# Altium schematic sheet 10_Clock.SchDoc: Clock
size A3; Organization: Lime Microsystems; Address1: Surrey Tech Centre; Address2: Guildford GU2 7YG; Address3: Surrey; Address4: United Kingdom; Revision: v1.0; SheetNumber: 10; SheetTotal: 11
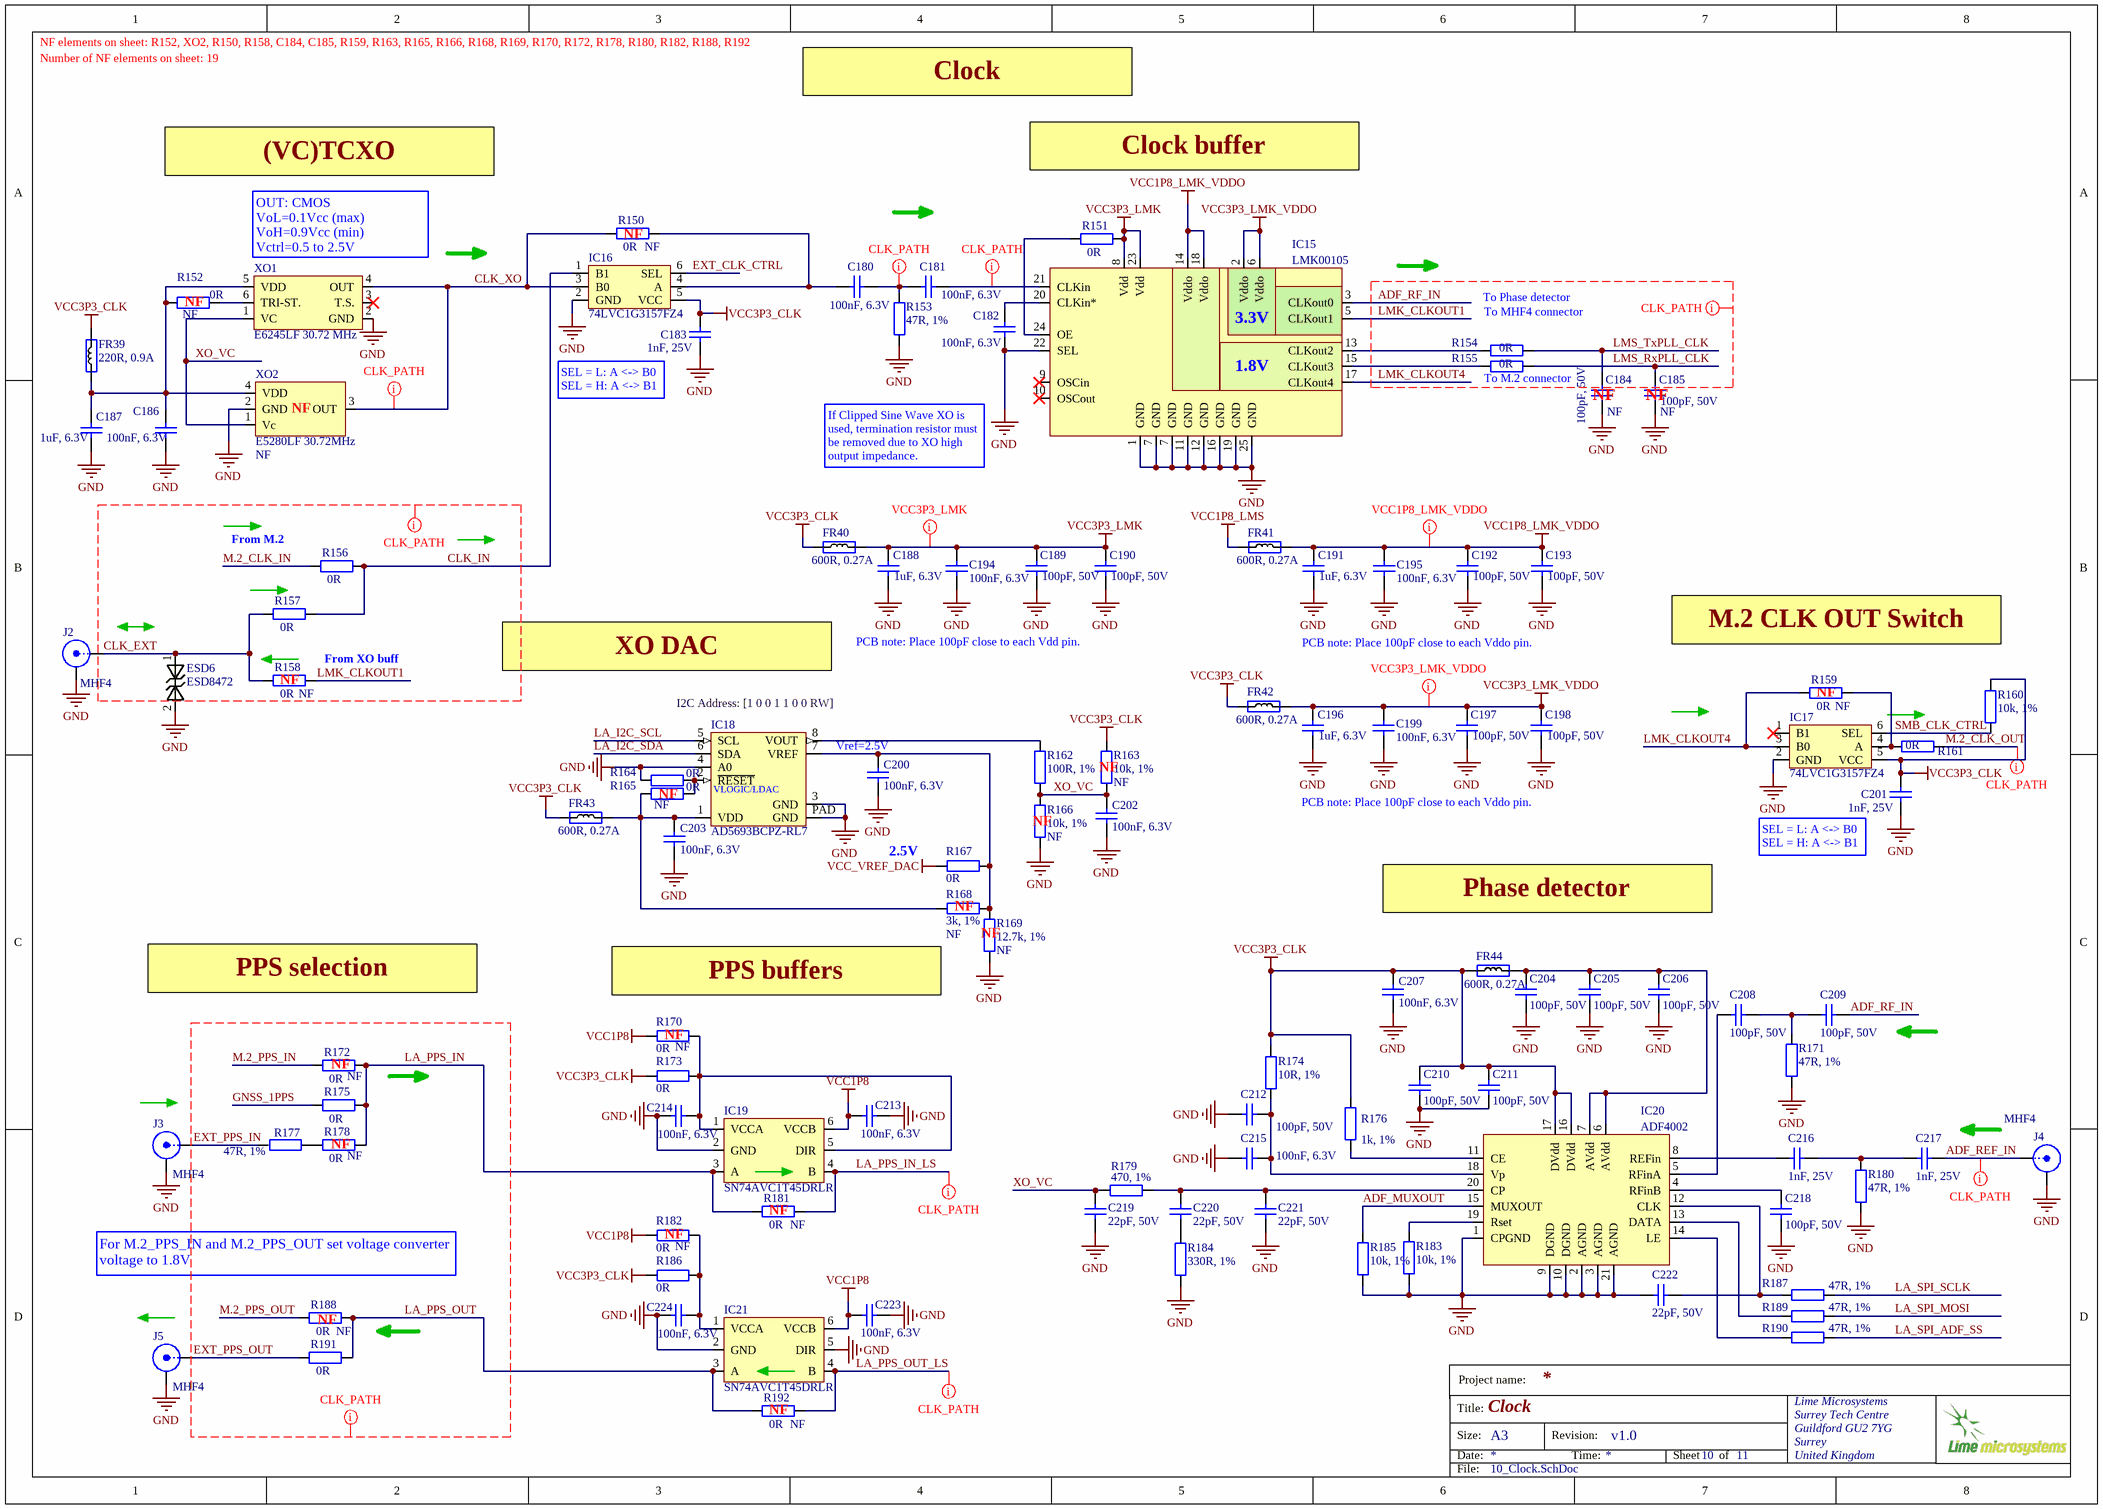
[diagram p0: 10_Clock.SchDoc]

## Parts
C180  100nF, 6.3V  [CAP0201]
C181  100nF, 6.3V  [CAP0201]
C182  100nF, 6.3V  [CAP0201]
C183  1nF, 25V  [CAP0201]
C184  100pF, 50V  Assembly Info: NF  [CAP0201]
C185  100pF, 50V  Assembly Info: NF  [CAP0201]
C186  100nF, 6.3V  [CAP0201]
C187  1uF, 6.3V  [CAP0201]
C188  1uF, 6.3V  [CAP0201]
C189  100pF, 50V  [CAP0201]
C190  100pF, 50V  [CAP0201]
C191  1uF, 6.3V  [CAP0201]
C192  100pF, 50V  [CAP0201]
C193  100pF, 50V  [CAP0201]
C194  100nF, 6.3V  [CAP0201]
C195  100nF, 6.3V  [CAP0201]
C196  1uF, 6.3V  [CAP0201]
C197  100pF, 50V  [CAP0201]
C198  100pF, 50V  [CAP0201]
C199  100nF, 6.3V  [CAP0201]
C200  100nF, 6.3V  [CAP0201]
C201  1nF, 25V  [CAP0201]
C202  100nF, 6.3V  [CAP0201]
C203  100nF, 6.3V  [CAP0201]
C204  100pF, 50V  [CAP0201]
C205  100pF, 50V  [CAP0201]
C206  100pF, 50V  [CAP0201]
C207  100nF, 6.3V  [CAP0201]
C208  100pF, 50V  [CAP0201]
C209  100pF, 50V  [CAP0201]
C210  100pF, 50V  [CAP0201]
C211  100pF, 50V  [CAP0201]
C212  100pF, 50V  [CAP0201]
C213  100nF, 6.3V  [CAP0201]
C214  100nF, 6.3V  [CAP0201]
C215  100nF, 6.3V  [CAP0201]
C216  1nF, 25V  [CAP0201]
C217  1nF, 25V  [CAP0201]
C218  100pF, 50V  [CAP0201]
C219  22pF, 50V  [CAP0201]
C220  22pF, 50V  [CAP0201]
C221  22pF, 50V  [CAP0201]
C222  22pF, 50V  [CAP0201]
C223  100nF, 6.3V  [CAP0201]
C224  100nF, 6.3V  [CAP0201]
ESD6  ESD8472  [ESD8472_X3DFN2]
FR39  220R, 0.9A  [RES0402]
FR40  600R, 0.27A  [RES0201]
FR41  600R, 0.27A  [RES0201]
FR42  600R, 0.27A  [RES0201]
FR43  600R, 0.27A  [RES0201]
FR44  600R, 0.27A  [RES0201]
IC15  LMK00105  [LMK00105SQ]
IC16  74LVC1G3157FZ4  [74LVC1G3157FZ4_SPDT_SW_DFN1410-6]
IC17  74LVC1G3157FZ4  [74LVC1G3157FZ4_SPDT_SW_DFN1410-6]
IC18  AD5693BCPZ-RL7  [AD5693RACPZ-1RL7_DAC_8LFCSP]
IC19  SN74AVC1T45DRLR  [SN74AVC1T45DRLR_SOT-5X3]
IC20  ADF4002  [ADF4002]
IC21  SN74AVC1T45DRLR  [SN74AVC1T45DRLR_SOT-5X3]
J2  MHF4  [IPEX_MHF4_conn]
J3  MHF4  [IPEX_MHF4_conn]
J4  MHF4  [IPEX_MHF4_conn]
J5  MHF4  [IPEX_MHF4_conn]
R150  0R  Assembly Info: NF  [RES0201]
R151  0R  [RES0201]
R152  0R  Assembly Info: NF  [RES0402]
R153  47R, 1%  [RES0201]
R154  0R  [RES0201]
R155  0R  [RES0201]
R156  0R  [RES0201]
R157  0R  [RES0201]
R158  0R  Assembly Info: NF  [RES0201]
R159  0R  Assembly Info: NF  [RES0201]
R160  10k, 1%  [RES0201]
R161  0R  [RES0201]
R162  100R, 1%  [RES0201]
R163  10k, 1%  Assembly Info: NF  [RES0201]
R164  0R  [RES0201]
R165  0R  Assembly Info: NF  [RES0201]
R166  10k, 1%  Assembly Info: NF  [RES0201]
R167  0R  [RES0201]
R168  3k, 1%  Assembly Info: NF  [RES0201]
R169  12.7k, 1%  Assembly Info: NF  [RES0201]
R170  0R  Assembly Info: NF  [RES0201]
R171  47R, 1%  [RES0201]
R172  0R  Assembly Info: NF  [RES0201]
R173  0R  [RES0201]
R174  10R, 1%  [RES0201]
R175  0R  [RES0201]
R176  1k, 1%  [RES0201]
R177  47R, 1%  [RES0201]
R178  0R  Assembly Info: NF  [RES0201]
R179  470, 1%  [RES0201]
R180  47R, 1%  [RES0201]
R181  0R  Assembly Info: NF  [RES0201]
R182  0R  Assembly Info: NF  [RES0201]
R183  10k, 1%  [RES0201]
R184  330R, 1%  [RES0201]
R185  10k, 1%  [RES0201]
R186  0R  [RES0201]
R187  47R, 1%  [RES0201]
R188  0R  Assembly Info: NF  [RES0201]
R189  47R, 1%  [RES0201]
R190  47R, 1%  [RES0201]
R191  0R  [RES0201]
R192  0R  Assembly Info: NF  [RES0201]
XO1  E6245LF 30.72 MHz  [RAKON_RPT7050A]
XO2  E5280LF 30.72MHz  Assembly Info: NF  [RAKON_TXCO]

## Nets
GND: C182.1 C183.1 C184.1 C185.1 C186.2 C187.2 C188.2 C189.1 C190.1 C191.2 C192.1 C193.1 C194.1 C195.1 C196.2 C197.1 C198.1 C199.1 C200.2 C201.1 C202.2 C203.2 C204.1 C205.1 C206.1 C207.2 C210.1 C211.1 C212.2 C213.2 C214.1 C215.1 C218.1 C219.1 C221.1 C222.2 C223.2 C224.1 ESD6.2 IC15.1(GND) IC15.7(GND) IC15.11(GND) IC15.12(GND) IC15.16(GND) IC15.19(GND) IC15.22(SEL) IC15.25(GND) IC16.2(GND) IC17.2(GND) IC18.3(GND) IC18.4(A0) IC18.PAD(GND) IC19.2(GND) IC20.1(CPGND) IC20.2(AGND) IC20.3(AGND) IC20.9(DGND) IC20.10(DGND) IC20.21(AGND) IC21.2(GND) IC21.5(DIR) J2.2(Y) J3.2(Y) J4.2(Y) J5.2(Y) R153.2 R164.1 R166.2 R169.2 R171.2 R180.1 R183.2 R184.2 R185.2 XO1.2(GND) XO2.2(GND)
VCC1P8: C213.1 C223.1 IC19.6(VCCB) IC21.6(VCCB) R170.2 R182.2
VCC1P8_LMK_VDDO: C191.1 C192.2 C193.2 C195.2 FR41.2 IC15.14(Vddo) IC15.18(Vddo)
VCC1P8_LMS: FR41.1
VCC3P3_CLK: C183.2 C201.2 C207.1 C210.2 C211.2 FR39.2 FR40.1 FR42.1 FR43.1 FR44.1 IC16.5(VCC) IC17.5(VCC) IC20.16(DVdd) IC20.17(DVdd) R160.2 R163.1 R173.2 R174.2 R176.1 R186.2
VCC3P3_LMK: C188.1 C189.2 C190.2 C194.2 FR40.2 IC15.8(Vdd) IC15.23(Vdd) R151.2
VCC3P3_LMK_VDDO: C196.1 C197.2 C198.2 C199.2 FR42.2 IC15.2(Vddo) IC15.6(Vddo)
VCC_VREF_DAC: R167.2
ADF_MUXOUT: IC20.15(MUXOUT) R185.1
ADF_REF_IN: C217.2 J4.1(X)
ADF_RF_IN: C209.1 IC15.3(CLKout0)
CLK_EXT: ESD6.1 J2.1(X) R157.1 R158.1
CLK_IN: IC16.1(B1) R156.2 R157.2
CLK_XO: IC16.3(B0) R150.1 XO1.4(OUT) XO2.3(OUT)
EXT_CLK_CTRL: IC16.6(SEL)
EXT_PPS_IN: J3.1(X) R177.2
EXT_PPS_OUT: J5.1(X) R191.1
GNSS_1PPS: R175.1
LA_I2C_SCL: IC18.5(SCL)
LA_I2C_SDA: IC18.6(SDA)
LA_PPS_IN: IC19.3(A) R172.2 R175.2 R178.2 R181.1
LA_PPS_IN_LS: IC19.4(B) R181.2
LA_PPS_OUT: IC21.3(A) R188.2 R191.2 R192.1
LA_PPS_OUT_LS: IC21.4(B) R192.2
LA_SPI_ADF_SS: R190.2
LA_SPI_MOSI: R189.2
LA_SPI_SCLK: R187.2
LMK_CLKOUT1: IC15.5(CLKout1) R158.2
LMK_CLKOUT4: IC15.17(CLKout4) IC17.3(B0) R159.1
LMS_RxPLL_CLK: C185.2 R155.2
LMS_TxPLL_CLK: C184.2 R154.2
M.2_CLK_IN: R156.1
M.2_CLK_OUT: R161.2
M.2_PPS_IN: R172.1
M.2_PPS_OUT: R188.1
SMB_CLK_CTRL: IC17.6(SEL) R160.1
XO_VC: C202.1 C219.2 R162.2 R163.2 R166.1 R179.1 XO1.1(VC) XO2.1(Vc)
NetC180_1: C180.1 C181.1 R153.1
NetC180_2: C180.2 IC16.4(A) R150.2
NetC181_2: C181.2 IC15.21(CLKin)
NetC182_2: C182.2 IC15.20(CLKin*)
NetC186_1: C186.1 C187.1 FR39.1 R152.2 XO1.5(VDD) XO2.4(VDD)
NetC200_1: C200.1 IC18.7(VREF) R167.1 R168.1 R169.1
NetC203_1: C203.1 FR43.2 IC18.1(VDD) R165.1 R168.2
NetC204_2: C204.2 C205.2 C206.2 FR44.2 IC20.6(AVdd) IC20.7(AVdd)
NetC208_1: C208.1 C209.2 R171.1
NetC208_2: C208.2 IC20.5(RFinA)
NetC212_1: C212.1 C215.2 IC20.18(Vp) R174.1
NetC214_2: C214.2 IC19.1(VCCA) IC19.5(DIR) R170.1 R173.1
NetC216_1: C216.1 IC20.8(REFin)
NetC216_2: C216.2 C217.1 R180.2
NetC218_2: C218.2 IC20.4(RFinB)
NetC220_1: C220.1 R184.1
NetC220_2: C220.2 C221.2 IC20.20(CP) R179.2
NetC222_1: C222.1 IC20.12(CLK) R187.1
NetC224_2: C224.2 IC21.1(VCCA) R182.1 R186.1
NetIC15_13: IC15.13(CLKout2) R154.1
NetIC15_15: IC15.15(CLKout3) R155.1
NetIC15_24: IC15.24(OE) R151.1
NetIC17_4: IC17.4(A) R159.2 R161.1
NetIC18_2: IC18.2(~{RESET}) R164.2 R165.2
NetIC18_8: IC18.8(VOUT) R162.1
NetIC20_11: IC20.11(CE) R176.2
NetIC20_13: IC20.13(DATA) R189.1
NetIC20_14: IC20.14(LE) R190.1
NetIC20_19: IC20.19(Rset) R183.1
NetR152_1: R152.1 XO1.6(TRI-ST.)
NetR177_1: R177.1 R178.1

Not connected (* = marked no-connect by the designer): IC15 9(OSCin)* 10(OSCout)*; IC17 1(B1)*; XO1 3(T.S.)*

## Layout directives
net class CLK_PATH: ADF_REF_IN, ADF_RF_IN, CLK_EXT, CLK_IN, CLK_XO, EXT_PPS_IN, EXT_PPS_OUT, GNSS_1PPS, LA_PPS_IN, LA_PPS_IN_LS, LA_PPS_OUT, LA_PPS_OUT_LS, LMK_CLKOUT1, LMK_CLKOUT4, LMS_RxPLL_CLK, LMS_TxPLL_CLK, M.2_CLK_IN, M.2_CLK_OUT, M.2_PPS_IN, M.2_PPS_OUT, NetC180_1, NetC181_2
net class VCC3P3_LMK: VCC3P3_LMK
net class VCC3P3_LMKRF: VCC1P8_LMK_VDDO
net class VCC3P3_LMK_VDDO: VCC3P3_LMK_VDDO

## Notes on the sheet
- NF elements on sheet: R152, XO2, R150, R158, C184, C185, R159, R163, R165, R166, R168, R169, R170, R172, R178, R180, R182, R188, R192
- Number of NF elements on sheet: 19
- Clock
- (VC)TCXO
- Clock buffer
- (near R150) NF
- (near R152) NF
- (near XO1) OUT: CMOS
  VoL=0.1Vcc (max)
  VoH=0.9Vcc (min)
  Vctrl=0.5 to 2.5V
- To Phase detector
- To MHF4 connector
- (near IC15) 1.8V
- (near IC15) 3.3V
- (near R155) To M.2 connector
- (near XO2) NF
- SEL = L: A <-> B0
  SEL = H: A <-> B1
- (near C184) NF
- (near C185) NF
- If Clipped Sine Wave XO is used, termination resistor must be removed due to XO high output impedance.
- From M.2
- PCB note: Place 100pF close to each Vdd pin.
- PCB note: Place 100pF close to each Vddo pin.
- M.2 CLK OUT Switch
- (near R158) NF
- (near R158) From XO buff
- XO DAC
- (near IC18) I2C Address: [1 0 0 1 1 0 0 RW]
- (near R159) NF
- (near C200) Vref=2.5V
- (near R163) NF
- (near R165) NF
- (near IC18) VLOGIC/LDAC
- (near R167) 2.5V
- (near R166) NF
- (near R168) NF
- Phase detector
- PPS selection
- PPS buffers
- (near R169) NF
- (near R170) NF
- (near R172) NF
- (near R178) NF
- (near R182) NF
- (near R181) NF
- (near R188) For M.2_PPS_IN and M.2_PPS_OUT set voltage converter voltage to 1.8V
- (near R188) NF
- (near R192) NF
- Project name:
- Title:
- Size:
- Date:
- A3
- Revision:
- Time:
- Sheet
- of
- File:

## Library data of the parts
C180-C182 C186 C194 C195 C199 C200 C202 C203 C207 C213-C215 C223 C224 = Cap_0402: Part Description: 0.1 µF ±20% 10V Ceramic Capacitor X5R 0201 (0603 Metric); Manufacturer: Samsung; Manufacturer Part Number 1: CL03A104MP3NNNC; Tolerance: 20%; Voltage Rating (DC): 10V; Value: 100nF, 6.3V; Capacitance: 100nF; Case/Package: 0201; Case Code (Imperial): 0201; Case Code (Metric): 0603; ComponentLink5Description: https://datasheet.ciiva.com/25788/cl03a104mp3nnnc-25788272.pdf?src-supplier=Digi-Key; ComponentLink5URL: https://datasheet.ciiva.com/25788/cl03a104mp3nnnc-25788272.pdf?src-supplier=Digi-Key; Length: 0.024inch; Max Operating Temperature: 85°C; Min Operating Temperature: -55°C; Mount: Surface Mount; Package Quantity: 1; Packaging: Tape and Reel; Pricing 1: 1=0,10000, 10=0,03000, 50=0,01640, 100=0,01330, 500=0,00950, 1000=0,00747, 2500=0,00679, 5000=0,00625 (USD); RoHS: Yes; RoHS Compliant: Yes; Series: CL; Stock 1: 3817176; Supplier 1: Digi-Key; Supplier Part Number 1: 1276-1321-1-ND; Thickness: 0.013inch; Voltage Rating: 10V; Width: 0.012inch
C183 C201 C216 C217 = Cap_0402: Manufacturer Part Number 1: C0603X7R1E102K030BA; Manufacturer: TDK Corporation; Part Description: 1000pF ±10% 25V X7R Ceramic Capacitor -55°C ~ 125°C Surface Mount, MLCC 0201 (0603 Metric) 0.024" L x 0.012" W (0.60mm x 0.30mm); Temperature Coefficient: X7R; Tolerance: ±10%; Capacitance: 1000pF; Value: 1nF, 25V; Supplier 1: Digi-Key; Supplier Part Number 1: 445-7275-1-ND; Voltage - Rated: 25V; Features: -; Package / Case: 0201 (0603 Metric); Lead Spacing: -; Mounting Type: Surface Mount, MLCC; Lead Style: -; Height - Seated (Max): -; Operating Temperature: -55°C ~ 125°C; Size / Dimension: 0.024" L x 0.012" W (0.60mm x 0.30mm); Applications: General Purpose; Ratings: -; Thickness (Max): 0.013" (0.33mm); RoHS: RoHS Compliant; Packaging: Cut Tape (CT); Category: Capacitors
C184 C185 C189 C190 C192 C193 C197 C198 = Cap_0402: Part Description: 100 pF ±5% 50V Ceramic Capacitor C0G, NP0 0201 (0603 Metric); Manufacturer: TDK; Manufacturer Part Number 1: C0603C0G1H101J030BA; Dielectric Material: Ceramic; Tolerance: 5%; Dielectric: C0G; Insulation Resistance: 10GR; Value: 100pF, 50V; Supplier 1: Digi-Key; Supplier Part Number 1: 445-1786-1-ND; Stock 1: 367528; Pricing 1: 1=0,10000, 10=0,06000, 50=0,03280, 100=0,02670, 500=0,01908, 1000=0,01500, 2500=0,01364, 5000=0,01254 (USD); RoHS: Yes; Mount: Surface Mount; Case/Package: 0201; Number of Pins: 2; Case Code (Metric): 0603; Case Code (Imperial): 0201; Weight: 6E-06oz; Min Operating Temperature: -55°C; Max Operating Temperature: 125°C; Package Quantity: 1; Capacitance: 100pF; Voltage Rating: 50V; Packaging: Tape and Reel; Voltage Rating (DC): 50V; Termination: SMD/SMT; Voltage: 50V; Series: C; Construction: Flat; Length: 0.6mm; Width: 0.012inch; Height: 0.3mm; Thickness: 0.013inch; Depth: 0.3mm; Reach SVHC Compliant: Yes; Lead Free: Lead Free; RoHS Compliant: Yes; ComponentLink1URL: https://datasheet.ciiva.com/24217/c0603c0g1h101j030ba-264106-24217425.pdf?src-supplier=Mouser; ComponentLink1Description: https://datasheet.ciiva.com/24217/c0603c0g1h101j030ba-264106-24217425.pdf?src-supplier=Mouser; ComponentLink2URL: https://datasheet.ciiva.com/16205/mlcc-commercial-general-en-16205590.pdf?src-supplier=Future+Electronics; ComponentLink2Description: https://datasheet.ciiva.com/16205/mlcc-commercial-general-en-16205590.pdf?src-supplier=Future+Electronics; ComponentLink3URL: https://datasheet.ciiva.com/6250/tdkmlcccaprange-6250351.pdf?src-supplier=Digi-Key; ComponentLink3Description: https://datasheet.ciiva.com/6250/tdkmlcccaprange-6250351.pdf?src-supplier=Digi-Key
C187 C188 C191 C196 = Cap_0402: Manufacturer: TDK Corporation; Manufacturer Part Number 1: JMK063ABJ105MP-F; Part Description: 1µF ±20% 6.3V X5R Ceramic Capacitor -55°C ~ 85°C Surface Mount, MLCC 0201 (0603 Metric) 0.024" L x 0.012" W (0.60mm x 0.30mm); Value: 1uF, 20%; Tolerance: ±20%; Capacitance: 1.0µF; Temperature Coefficient: X5R; Supplier 1: Digi-Key; Supplier Part Number 1: 587-5864-2-ND; Applications: General Purpose; Features: -; Lead Style: -; Ratings: -; Thickness (Max): -; Lead Spacing: -; Height - Seated (Max): -; Size / Dimension: 0.024" L x 0.012" W (0.60mm x 0.30mm); Mounting Type: Surface Mount, MLCC; Operating Temperature: -55°C ~ 85°C; Package / Case: 0201 (0603 Metric); Packaging: Cut Tape (CT); Voltage - Rated: 6.3V; Category: Capacitors; RoHS: RoHS Compliant
C204-C206 C208-C212 C218 = Cap_0402: Part Description: 100 pF ±5% 50V Ceramic Capacitor C0G, NP0 0201 (0603 Metric); Manufacturer: TDK; Manufacturer Part Number 1: C0603C0G1H101J030BA; Dielectric: C0G; Dielectric Material: Ceramic; Insulation Resistance: 10GR; Tolerance: 5%; Value: 100pF, 50V; Capacitance: 100pF; Case/Package: 0201; Case Code (Imperial): 0201; Case Code (Metric): 0603; ComponentLink1Description: https://datasheet.ciiva.com/24217/c0603c0g1h101j030ba-264106-24217425.pdf?src-supplier=Mouser; ComponentLink1URL: https://datasheet.ciiva.com/24217/c0603c0g1h101j030ba-264106-24217425.pdf?src-supplier=Mouser; ComponentLink2Description: https://datasheet.ciiva.com/16205/mlcc-commercial-general-en-16205590.pdf?src-supplier=Future+Electronics; ComponentLink2URL: https://datasheet.ciiva.com/16205/mlcc-commercial-general-en-16205590.pdf?src-supplier=Future+Electronics; ComponentLink3Description: https://datasheet.ciiva.com/6250/tdkmlcccaprange-6250351.pdf?src-supplier=Digi-Key; ComponentLink3URL: https://datasheet.ciiva.com/6250/tdkmlcccaprange-6250351.pdf?src-supplier=Digi-Key; Construction: Flat; Depth: 0.3mm; Height: 0.3mm; Lead Free: Lead Free; Length: 0.6mm; Max Operating Temperature: 125°C; Min Operating Temperature: -55°C; Mount: Surface Mount; Number of Pins: 2; Package Quantity: 1; Packaging: Tape and Reel; Pricing 1: 1=0,10000, 10=0,06000, 50=0,03280, 100=0,02670, 500=0,01908, 1000=0,01500, 2500=0,01364, 5000=0,01254 (USD); Reach SVHC Compliant: Yes; RoHS: Yes; RoHS Compliant: Yes; Series: C; Stock 1: 367528; Supplier 1: Digi-Key; Supplier Part Number 1: 445-1786-1-ND; Termination: SMD/SMT; Thickness: 0.013inch; Voltage: 50V; Voltage Rating (DC): 50V; Voltage Rating: 50V; Weight: 6E-06oz; Width: 0.012inch
C219-C222 = Cap_0402: Manufacturer: Murata; Manufacturer Part Number 1: GRM0335C1H220JA01D; Part Description: 22 pF ±5% 50V Ceramic Capacitor C0G, NP0 0201 (0603 Metric); Tolerance: 5%; Dielectric: C0G; Value: 22pF, 50V; Supplier 1: Digi-Key; Supplier Part Number 1: 490-6123-1-ND; Stock 1: 2966748; Pricing 1: 1=0,10000, 10=0,01300, 50=0,00720, 100=0,00590, 500=0,00424, 1000=0,00333, 2500=0,00303, 5000=0,00279 (USD); RoHS: Yes; Mount: Surface Mount; Case/Package: 0201; Case Code (Metric): 0603; Case Code (Imperial): 0201; Min Operating Temperature: -55°C; Max Operating Temperature: 125°C; Package Quantity: 15000; Capacitance: 22pF; Voltage Rating: 50V; Packaging: Tape and Reel; Termination: SMD/SMT; Voltage: 50V; Voltage Rating (DC): 50V; Series: GRM; Length: 0.6mm; Width: 0.012inch; Height: 0.3mm; Thickness: 0.013inch; Depth: 0.3mm; Lead Free: Lead Free; RoHS Compliant: Yes; ComponentLink1URL: https://datasheet.ciiva.com/6271/partnumbering-e-01-6271146.pdf?src-supplier=Digi-Key; ComponentLink1Description: https://datasheet.ciiva.com/6271/partnumbering-e-01-6271146.pdf?src-supplier=Digi-Key; ComponentLink2URL: https://datasheet.ciiva.com/6271/partnumbering-e-01-6271143.pdf?src-supplier=Digi-Key; ComponentLink2Description: https://datasheet.ciiva.com/6271/partnumbering-e-01-6271143.pdf?src-supplier=Digi-Key; ComponentLink3URL: https://datasheet.ciiva.com/6271/partnumbering-e-01-6271149.pdf?src-supplier=Digi-Key; ComponentLink3Description: https://datasheet.ciiva.com/6271/partnumbering-e-01-6271149.pdf?src-supplier=Digi-Key
ESD6 = ESD8472: Manufacturer: ON Semiconductor; Manufacturer Part Number 1: ESD8472MUT5G; Part Description: TVS DIODE 5.3VWM 14VC X3DFN2; Voltage - Reverse Standoff (Typ): 5.3V (Max); Voltage - Breakdown (Min): 7V; Voltage - Clamping (Max) @ Ipp: 14V; Current - Peak Pulse (10/1000µs): 3A (8/20µs); Power Line Protection: No; Capacitance @ Frequency: 0.2pF @ 1MHz; Supplier 1: Digi-Key; RoHS: RoHS Compliant; Category: Circuit Protection; Stock 1: 2295; Pricing 1: 1=0.39, 10=0.315, 100=0.2142, 500=0.16068, 1000=0.12051 (USD); Packaging: Cut Tape (CT); Part Status: Active; Type: Zener; Power - Peak Pulse: -; Applications: Automotive, RF Antenna; Operating Temperature: -55°C ~ 150°C (TJ); Mounting Type: Surface Mount; Package / Case: 2-XFDFN; Supplier Device Package: 2-X3DFN (0.62x0.32); ComponentLink1URL: http://www.onsemi.com/pub/Collateral/ESD8472-D.PDF; ComponentLink1Description: http://www.onsemi.com/pub/Collateral/ESD8472-D.PDF; Supplier Part Number 1: ESD8472MUT5GOSCT-ND
FR39 = Ferrite: Manufacturer: TDK Corporation; Manufacturer Part Number 1: MPZ1005S221ET000; Part Description: FERRITE BEAD 220 OHM 0402 1LN; Impedance @ Frequency: 220 Ohm @ 100MHz; Current Rating: 900mA; DC Resistance (DCR): 220 mOhm Max; Supplier 1: Digi-Key; Package / Case: 0402 (1005 Metric); Category: Filters; Supplier Part Number 1: 445-9329-2-ND; Value: 220R, 0.9A
FR40-FR44 = Ferrite: Manufacturer Part Number 1: BK0603TS601-T; Manufacturer: Taiyo Yuden; Part Description: FERRITE BEAD 600 OHM 0201 1LN; DC Resistance (DCR): 750 mOhm Max; Filter Type: Differential Mode - Single; Impedance @ Frequency: 600 Ohm @ 100MHz; Current Rating: 270mA; Value: 600R@100MHz; Supplier 1: Digi-Key; Supplier Part Number 1: 587-3277-1-ND; Size / Dimension: 0.024" L x 0.012" W (0.60mm x 0.30mm); Package / Case: 0201 (0603 Metric); Height (Max): 0.013" (0.33mm); Mounting Type: Surface Mount; Packaging: Cut Tape (CT); RoHS: RoHS Compliant; Category: Filters
IC15 = LMK00105: Manufacturer: Texas Instruments; Manufacturer Part Number 1: LMK00105SQ/NOPB; Part Description: IC CLK BUFFER 2:5 200MHZ 24WQFN; Frequency - Max: 200MHz; Voltage - Supply: 2.375 V ~ 3.45 V; Input: HCSL, LVCMOS, LVDS, LVPECL, LVTTL, SSTL, Crystal; Differential - Input:Output: Yes/No; Supplier 1: Digi-Key; Type: Fanout Buffer (Distribution), Multiplexer, Translator; Category: Integrated Circuits (ICs); Operating Temperature: -40°C ~ 85°C; Package / Case: 24-WFQFN Exposed Pad; Supplier Device Package: 24-WQFN (4x4); Supplier Part Number 1: LMK00105SQ/NOPBCT-ND
IC16 IC17 = 74LVC1G3157FZ4_SPDT_SW: Part Description: 1 Circuit IC Switch 2:1 10Ohm X2-DFN1410-6; Manufacturer: Diodes; Manufacturer Part Number 1: 74LVC1G3157FZ4-7; Number of Circuits: 1; On-State Resistance: 10R; -3db Bandwidth: 300MHz; Supplier 1: Digi-Key; Supplier Part Number 1: 74LVC1G3157FZ4-7DICT-ND; Stock 1: 158709; Pricing 1: 1=0,42000, 10=0,31200, 25=0,27320, 100=0,17670, 250=0,14628, 500=0,11702, 1000=0,08972, 2500=0,07802 (USD); RoHS: Yes; Number of Pins: 6; Min Operating Temperature: -40°C; Max Operating Temperature: 125°C; Packaging: Tape and Reel; RoHS Compliant: Yes; ComponentLink1URL: https://www.diodes.com/assets/Datasheets/74LVC1G3157.pdf?src-supplier=Digi-Key; ComponentLink1Description: https://www.diodes.com/assets/Datasheets/74LVC1G3157.pdf?src-supplier=Digi-Key; ComponentLink2URL: https://www.diodes.com/assets/product-showcases/74LVC3157-NPA-0516.pdf?src-supplier=Digi-Key; ComponentLink2Description: https://www.diodes.com/assets/product-showcases/74LVC3157-NPA-0516.pdf?src-supplier=Digi-Key
IC18 = AD5693RACPZ-1RL7_DAC: Part Description: 16 Bit Digital to Analog Converter 1 8-LFCSP-UD (2x2); Manufacturer: Analog Devices; ComponentLink1URL: http://www.mouser.com/ds/2/609/AD5693R_5692R_5691R_5693-534178.pdf?src-supplier=Mouser; ComponentLink1Description: http://www.mouser.com/ds/2/609/AD5693R_5692R_5691R_5693-534178.pdf?src-supplier=Mouser; ComponentLink2URL: https://www.analog.com/media/en/technical-documentation/data-sheets/AD5693R_5692R_5691R_5693.pdf?src-supplier=Digi-Key; ComponentLink2Description: https://www.analog.com/media/en/technical-documentation/data-sheets/AD5693R_5692R_5691R_5693.pdf?src-supplier=Digi-Key; ComponentLink3URL: http://www.analog.com/static/imported-files/data_sheets/AD5693R_5692R_5691R.pdf?src-supplier=Avnet; ComponentLink3Description: http://www.analog.com/static/imported-files/data_sheets/AD5693R_5692R_5691R.pdf?src-supplier=Avnet; ComponentLink4URL: http://www.analog.com/media/en/technical-documentation/data-sheets/AD5693R_5692R_5691R_5693.pdf?src-supplier=Digi-Key; ComponentLink4Description: http://www.analog.com/media/en/technical-documentation/data-sheets/AD5693R_5692R_5691R_5693.pdf?src-supplier=Digi-Key; Supplier 1: Digikey; Supplier Part Number 1: 505-AD5693BCPZ-RL7CT-ND; Manufacturer Part Number 1: AD5693BCPZ-RL7; Stock 1: 5532; Pricing 1: 1=9,21, 10=6,366, 25=5,6328, 100=4,8123, 250=4,41452, 500=4,17228, 1000=3,97118 (USD); RoHS: Yes; ComponentLink5URL: https://www.analog.com/media/en/technical-documentation/data-sheets/AD5693R_5692R_5691R_5693.pdf?src-supplier=Digikey; ComponentLink5Description: https://www.analog.com/media/en/technical-documentation/data-sheets/AD5693R_5692R_5691R_5693.pdf?src-supplier=Digikey; ComponentLink6URL: http://www.analog.com/media/en/technical-documentation/data-sheets/AD5693R_5692R_5691R_5693.pdf?src-supplier=Digikey; ComponentLink6Description: http://www.analog.com/media/en/technical-documentation/data-sheets/AD5693R_5692R_5691R_5693.pdf?src-supplier=Digikey; ComponentLink7URL: http://www.analog.com/static/imported-files/data_sheets/AD5693R_5692R_5691R_5693.pdf?src-supplier=Avnet; ComponentLink7Description: http://www.analog.com/static/imported-files/data_sheets/AD5693R_5692R_5691R_5693.pdf?src-supplier=Avnet; ComponentLink8URL: http://www.farnell.com/datasheets/1863077.pdf?src-supplier=Element14; ComponentLink8Description: http://www.farnell.com/datasheets/1863077.pdf?src-supplier=Element14; ComponentLink9URL: https://datasheet.octopart.com/AD5693BCPZ-RL7-Analog-Devices-datasheet-79096046.pdf?src-supplier=Element14; ComponentLink9Description: https://datasheet.octopart.com/AD5693BCPZ-RL7-Analog-Devices-datasheet-79096046.pdf?src-supplier=Element14
IC19 IC21 = SN74AVC1T45DRLR_lvl_translator: Part Description: Voltage Level Translator Bidirectional 1 Circuit 1 Channel 500Mbps SOT-5X3; Manufacturer: Texas Instruments; Supplier 1: Digi-Key; Supplier Part Number 1: 296-21022-1-ND; Manufacturer Part Number 1: SN74AVC1T45DRLR; Stock 1: 46610; Pricing 1: 1=0,68, 10=0,6, 25=0,5636, 100=0,46, 250=0,42724, 500=0,3636, 1000=0,29088 (USD); RoHS: Yes; Length: 1.6mm; Width: 1.2mm; Height: 600um; Thickness: 550um; ComponentLink1URL: https://datasheet.ciiva.com/1629/sn74avc1t45-1629536.pdf?src-supplier=Newark; ComponentLink1Description: https://datasheet.ciiva.com/1629/sn74avc1t45-1629536.pdf?src-supplier=Newark; ComponentLink2URL: https://datasheet.ciiva.com/15086/getdatasheetpartid-223729-15086386.pdf?src-supplier=Verical; ComponentLink2Description: https://datasheet.ciiva.com/15086/getdatasheetpartid-223729-15086386.pdf?src-supplier=Verical; ComponentLink3URL: https://datasheet.ciiva.com/14287/sn74avc1t45-14287328.pdf?src-supplier=Avnet; ComponentLink3Description: https://datasheet.ciiva.com/14287/sn74avc1t45-14287328.pdf?src-supplier=Avnet; ComponentLink4URL: https://datasheet.ciiva.com/22729/1862374-22729941.pdf?src-supplier=Element14; ComponentLink4Description: https://datasheet.ciiva.com/22729/1862374-22729941.pdf?src-supplier=Element14; ComponentLink5URL: https://datasheet.ciiva.com/46385/1887534-46385799.pdf?src-supplier=Element14; ComponentLink5Description: https://datasheet.ciiva.com/46385/1887534-46385799.pdf?src-supplier=Element14; ComponentLink6URL: https://datasheet.ciiva.com/14287/sn74avc1t45-14287479.pdf?src-supplier=Avnet; ComponentLink6Description: https://datasheet.ciiva.com/14287/sn74avc1t45-14287479.pdf?src-supplier=Avnet; ComponentLink7URL: https://datasheet.ciiva.com/1899/sn74avc1t45-1899278.pdf?src-supplier=Digi-Key; ComponentLink7Description: https://datasheet.ciiva.com/1899/sn74avc1t45-1899278.pdf?src-supplier=Digi-Key; ComponentLink8URL: https://datasheet.ciiva.com/1899/sn74avc1t45-1899279.pdf?src-supplier=Digi-Key; ComponentLink8Description: https://datasheet.ciiva.com/1899/sn74avc1t45-1899279.pdf?src-supplier=Digi-Key; ComponentLink9URL: https://datasheet.ciiva.com/1899/sn74avc1t45-1899280.pdf?src-supplier=Digi-Key; ComponentLink9Description: https://datasheet.ciiva.com/1899/sn74avc1t45-1899280.pdf?src-supplier=Digi-Key
IC20 = ADF4002: Manufacturer: Analog Devices Inc; Manufacturer Part Number 1: ADF4002BCPZ-RL7; Part Description: IC PLL FREQUENCY SYNTH 20-LFCSP; Ratio - Input:Output: 2:1; Differential - Input:Output: Yes/No; Input: CMOS, TTL; Voltage - Supply: 2.7 V ~ 3.3 V; Supplier 1: Digi-Key; Supplier: Digi-Key; Category: Integrated Circuits (ICs); Type: Clock/Frequency Synthesizer (RF), Phase Detector; Operating Temperature: -40°C ~ 85°C; Mounting Type: Surface Mount; Package / Case: 20-VFQFN Exposed Pad, CSP; Supplier Part Number 1: ADF4002BCPZ-RL7CT-ND
J2-J5 = RF_IF_connector: IPEX MHF4 Connector Jack, Male Pin 50 Ohms Surface Mount Solder; Manufacturer: TE Connectivity / Linx Technologies; Manufacturer Part Number 1: CONMHF4-SMD-G-T; Part Description: IPEX MHF4 Connector Jack, Male Pin 50 Ohms Surface Mount Solder; Pricing 1: 1=0,22 (USD); RoHS: No; Stock 1: 15668; Supplier 1: Digikey; Supplier Part Number 1: 343-CONMHF4-SMD-G-TCT-ND
R150 R151 R154-R159 R161 R164 R165 R170 R172 R173 R175 R178 R181 R182 R186 R188 R191 R192 = Res_0402: Part Description: 0 Ohms Jumper Chip Resistor 0201 (0603 Metric) Moisture Resistant Thick Film; Manufacturer: Yageo; Manufacturer Part Number 1: RC0201JR-070RL; Power Rating: 50mW; Tolerance: 5%; Voltage Rating: 25V; ComponentLink1URL: http://www.yageo.com/documents/recent/PYu-RC_Group_51_RoHS_L_7.pdf; ComponentLink1Description: http://www.yageo.com/documents/recent/PYu-RC_Group_51_RoHS_L_7.pdf; Value: 0R; Supplier 1: Digi-Key; Supplier Part Number 1: 311-0.0NCT-ND; Stock 1: 6252381; Pricing 1: 1=0,10000, 10=0,03700, 25=0,02680, 50=0,02020, 100=0,01500, 250=0,01140, 500=0,00912, 1000=0,00672, 5000=0,00482 (USD); RoHS: Yes; Case/Package: 0201; Case Code (Metric): 0603; Case Code (Imperial): 0201; Weight: 6E-06oz; Contact Plating: Tin,Matte; Size Code: 0201; Min Operating Temperature: -55°C; Max Operating Temperature: 125°C; Packaging: Tape and Reel; Resistance: 0R; Package Quantity: 1; Resistor Type: Thick Film; Number of Terminations: 2; Termination: SMD/SMT; Max Power Dissipation: 50mW; Voltage Rating (DC): 25V; Features: Moisture Resistant; Series: RC; Construction: Rectangular; Resistance Tolerance: 5%; Length: 0.024inch; Width: 0.012inch; Height: 0.01inch; Depth: 0.3mm; Radiation Hardening: No; Military Standard: Not; Lead Free: Lead Free; RoHS Compliant: Yes; ComponentLink2URL: https://datasheet.ciiva.com/7672/1563626-7672248.pdf?src-supplier=Element14; ComponentLink2Description: https://datasheet.ciiva.com/7672/1563626-7672248.pdf?src-supplier=Element14; ComponentLink3URL: https://datasheet.ciiva.com/7672/1563626-7672247.pdf?src-supplier=Element14; ComponentLink3Description: https://datasheet.ciiva.com/7672/1563626-7672247.pdf?src-supplier=Element14; ComponentLink4URL: https://datasheet.ciiva.com/7660/1421516-7660808.pdf?src-supplier=Element14; ComponentLink4Description: https://datasheet.ciiva.com/7660/1421516-7660808.pdf?src-supplier=Element14; ComponentLink5URL: https://datasheet.ciiva.com/46391/1421516-46391340.pdf?src-supplier=Element14; ComponentLink5Description: https://datasheet.ciiva.com/46391/1421516-46391340.pdf?src-supplier=Element14
R152 = Res_0402: Manufacturer Part Number 1: RC0402JR-070RL; Manufacturer: Yageo; Part Description: RES SMD 0.0OHM JUMPER 1/16W 0402; Resistance (Ohms): 0.0; Tolerance: Jumper; Power (Watts): 0.063W, 1/16W; Value: 0R; Supplier 1: Digi-Key; Supplier Part Number 1: 311-0.0JRTR-ND; Category: Resistors; Temperature Coefficient: -; Features: Moisture Resistant; Supplier Device Package: 0402; Height: 0.016" (0.40mm); Package / Case: 0402 (1005 Metric); Operating Temperature: -55°C ~ 155°C; Size / Dimension: 0.039" L x 0.020" W (1.00mm x 0.50mm); Composition: Thick Film; Packaging: Tape & Reel (TR); Number of Terminations: 2; RoHS: RoHS Compliant
R153 R171 R177 R180 R187 R189 R190 = Res_0402: Manufacturer: Yageo; Manufacturer Part Number 1: RC0201FR-0747RL; Part Description: 47 Ohms ±1% 0.05W, 1/20W Chip Resistor 0201 (0603 Metric) Moisture Resistant Thick Film; Power Rating: 50mW; Voltage Rating: 25V; Temperature Coefficient: 200ppm/°C; Value: 47R, 1%; Supplier 1: Digi-Key; Supplier Part Number 1: YAG2694CT-ND; Stock 1: 778022; Pricing 1: 1=0,10000, 10=0,03700, 100=0,01530, 1000=0,00685, 2500=0,00595, 5000=0,00491 (USD); RoHS: Yes; Case/Package: 0201; Case Code (Imperial): 0201; Case Code (Metric): 0603; Min Operating Temperature: -55°C; Max Operating Temperature: 125°C; Packaging: Tape and Reel; Resistance: 47R; Tolerance: 1%; Resistor Type: Thick Film; Termination: SMD/SMT; Number of Terminations: 2; Max Power Dissipation: 50mW; Features: Moisture Resistant; Series: RC; Resistance Tolerance: 1%; Length: 0.6mm; Width: 0.3mm; Height: 0.23mm; Reach SVHC Compliant: Yes; RoHS Compliant: Yes; ComponentLink1URL: https://datasheet.ciiva.com/5924/1563626-5924912.pdf?src-supplier=Farnell; ComponentLink1Description: https://datasheet.ciiva.com/5924/1563626-5924912.pdf?src-supplier=Farnell; ComponentLink2URL: https://datasheet.ciiva.com/22661/1563626-22661319.pdf?src-supplier=Element14; ComponentLink2Description: https://datasheet.ciiva.com/22661/1563626-22661319.pdf?src-supplier=Element14
R160 R163 R166 R183 R185 = Res_0402: Manufacturer: Yageo; Manufacturer Part Number 1: RC0201FR-0710KL; Part Description: 10 kOhms ±1% 0.05W, 1/20W Chip Resistor 0201 (0603 Metric) Moisture Resistant Thick Film; Resistance: 10kR; Power Rating: 50mW; Voltage Rating: 25V; Temperature Coefficient: 200ppm/°C; Value: 10k, 1%; ComponentLink1URL: https://datasheet.ciiva.com/5924/1563626-5924912.pdf?src-supplier=Farnell; ComponentLink1Description: https://datasheet.ciiva.com/5924/1563626-5924912.pdf?src-supplier=Farnell; ComponentLink2URL: https://datasheet.ciiva.com/22661/1563626-22661319.pdf?src-supplier=Element14; ComponentLink2Description: https://datasheet.ciiva.com/22661/1563626-22661319.pdf?src-supplier=Element14; Supplier 1: Digi-Key; Supplier Part Number 1: 311-10.0KMCT-ND; Stock 1: 17142315; Pricing 1: 1=0,10000, 10=0,03700, 100=0,01530, 1000=0,00685, 2500=0,00595, 5000=0,00491 (USD); RoHS: Yes; Case/Package: 0201; Number of Pins: 2; Case Code (Imperial): 0201; Case Code (Metric): 0603; Contact Plating: Tin,Matte; Weight: 6E-06oz; Min Operating Temperature: -55°C; Max Operating Temperature: 125°C; Tolerance: 1%; Packaging: Tape and Reel; Package Quantity: 10000; Termination: SMD/SMT; Resistor Type: Thick Film; Number of Terminations: 2; Max Power Dissipation: 50mW; Voltage Rating (DC): 25V; Features: Moisture Resistant; Series: RC; Resistance Tolerance: 1%; Construction: Rectangular; Working Voltage: 25V; Technology: THICK FILM; Length: 0.6mm; Width: 0.012inch; Height: 0.01inch; Depth: 0.3mm; Radiation Hardening: No; Reach SVHC Compliant: Yes; Military Standard: Not; Lead Free: Lead Free; RoHS Compliant: Yes; ComponentLink3URL: https://datasheet.ciiva.com/7660/1421516-7660807.pdf?src-supplier=Element14; ComponentLink3Description: https://datasheet.ciiva.com/7660/1421516-7660807.pdf?src-supplier=Element14; ComponentLink4URL: https://datasheet.ciiva.com/46391/1421516-46391339.pdf?src-supplier=Element14; ComponentLink4Description: https://datasheet.ciiva.com/46391/1421516-46391339.pdf?src-supplier=Element14; ComponentLink5URL: https://datasheet.ciiva.com/2467/pyu-r-int-thick-7-2467110.pdf?src-supplier=Digi-Key; ComponentLink5Description: https://datasheet.ciiva.com/2467/pyu-r-int-thick-7-2467110.pdf?src-supplier=Digi-Key; ComponentLink6URL: https://datasheet.ciiva.com/2467/pyu-r-int-thick-7-2467111.pdf?src-supplier=Digi-Key; ComponentLink6Description: https://datasheet.ciiva.com/2467/pyu-r-int-thick-7-2467111.pdf?src-supplier=Digi-Key; ComponentLink7URL: https://datasheet.ciiva.com/2467/pyu-r-int-thick-7-2467109.pdf?src-supplier=Digi-Key; ComponentLink7Description: https://datasheet.ciiva.com/2467/pyu-r-int-thick-7-2467109.pdf?src-supplier=Digi-Key
R162 = Res_0402: Manufacturer: Yageo; Manufacturer Part Number 1: RC0201FR-07100RL; Part Description: 100 Ohms ±1% 0.05W, 1/20W Chip Resistor 0201 (0603 Metric) Moisture Resistant Thick Film; Power Rating: 50mW; Voltage Rating: 25V; Temperature Coefficient: 200ppm/°C; ComponentLink1URL: http://www.yageo.com/documents/recent/PYu-RC_Group_51_RoHS_L_7.pdf; ComponentLink1Description: http://www.yageo.com/documents/recent/PYu-RC_Group_51_RoHS_L_7.pdf; Value: 100R, 1%; Supplier 1: Digi-Key; Supplier Part Number 1: 311-100MCT-ND; Stock 1: 1625377; Pricing 1: 1=0,10000, 10=0,03700, 100=0,01530, 1000=0,00685, 2500=0,00595, 5000=0,00491 (USD); RoHS: Yes; Case/Package: 0201; Case Code (Metric): 0603; Case Code (Imperial): 0201; Contact Plating: Tin,Matte; Size Code: 0201; Min Operating Temperature: -55°C; Max Operating Temperature: 125°C; Resistance: 100R; Tolerance: 1%; Packaging: Cut Tape; Package Quantity: 1; Resistor Type: Thick Film; Number of Terminations: 2; Termination: SMD/SMT; Max Power Dissipation: 50mW; Features: Moisture Resistant; Series: RC; Resistance Tolerance: 1%; Length: 0.024inch; Width: 0.012inch; Height: 0.01inch; Radiation Hardening: No; Lead Free: Lead Free; RoHS Compliant: Yes; ComponentLink2URL: https://datasheet.ciiva.com/2560/pyu-r-int-thick-7-2560866.pdf?src-supplier=Digi-Key; ComponentLink2Description: https://datasheet.ciiva.com/2560/pyu-r-int-thick-7-2560866.pdf?src-supplier=Digi-Key; ComponentLink3URL: https://datasheet.ciiva.com/2560/pyu-r-int-thick-7-2560867.pdf?src-supplier=Digi-Key; ComponentLink3Description: https://datasheet.ciiva.com/2560/pyu-r-int-thick-7-2560867.pdf?src-supplier=Digi-Key; ComponentLink4URL: https://datasheet.ciiva.com/2560/pyu-r-int-thick-7-2560865.pdf?src-supplier=Digi-Key; ComponentLink4Description: https://datasheet.ciiva.com/2560/pyu-r-int-thick-7-2560865.pdf?src-supplier=Digi-Key; ComponentLink5URL: https://datasheet.ciiva.com/8887/pyu-rc0201-51-rohs-l-8-8887865.pdf?src-supplier=Avnet; ComponentLink5Description: https://datasheet.ciiva.com/8887/pyu-rc0201-51-rohs-l-8-8887865.pdf?src-supplier=Avnet
R167 = Res_0402: Manufacturer: Yageo; Manufacturer Part Number 1: RC0201JR-070RL; Part Description: 0 Ohms Jumper Chip Resistor 0201 (0603 Metric) Moisture Resistant Thick Film; Power Rating: 50mW; Tolerance: 5%; Voltage Rating: 25V; Value: 0R; Supplier 1: Digi-Key; Supplier Part Number 1: 311-0.0NCT-ND; Stock 1: 6252381; Pricing 1: 1=0,10000, 10=0,03700, 25=0,02680, 50=0,02020, 100=0,01500, 250=0,01140, 500=0,00912, 1000=0,00672, 5000=0,00482 (USD); RoHS: Yes; Case/Package: 0201; Case Code (Metric): 0603; Case Code (Imperial): 0201; Contact Plating: Tin,Matte; Min Operating Temperature: -55°C; Max Operating Temperature: 125°C; Package Quantity: 1; Packaging: Tape and Reel; Resistance: 0R; Resistor Type: Thick Film; Number of Terminations: 2; Termination: SMD/SMT; Max Power Dissipation: 50mW; Features: Moisture Resistant; Series: RC; Resistance Tolerance: 5%; Construction: Rectangular; Length: 0.024inch; Width: 0.012inch; Height: 0.01inch; Depth: 0.3mm; Radiation Hardening: No; Military Standard: Not; Lead Free: Lead Free; RoHS Compliant: Yes; ComponentLink1URL: http://www.yageo.com/documents/recent/PYu-RC_Group_51_RoHS_L_7.pdf; ComponentLink1Description: http://www.yageo.com/documents/recent/PYu-RC_Group_51_RoHS_L_7.pdf; ComponentLink2URL: https://datasheet.ciiva.com/7672/1563626-7672248.pdf?src-supplier=Element14; ComponentLink2Description: https://datasheet.ciiva.com/7672/1563626-7672248.pdf?src-supplier=Element14; ComponentLink3URL: https://datasheet.ciiva.com/7672/1563626-7672247.pdf?src-supplier=Element14; ComponentLink3Description: https://datasheet.ciiva.com/7672/1563626-7672247.pdf?src-supplier=Element14; ComponentLink4URL: https://datasheet.ciiva.com/7660/1421516-7660808.pdf?src-supplier=Element14; ComponentLink4Description: https://datasheet.ciiva.com/7660/1421516-7660808.pdf?src-supplier=Element14; ComponentLink5URL: https://datasheet.ciiva.com/46391/1421516-46391340.pdf?src-supplier=Element14; ComponentLink5Description: https://datasheet.ciiva.com/46391/1421516-46391340.pdf?src-supplier=Element14; Size Code: 0201; Voltage Rating (DC): 25V; Weight: 6E-06oz
R168 = Res_0402: Part Description: 3 kOhms ±1% 0.05W, 1/20W Chip Resistor 0201 (0603 Metric) Moisture Resistant Thick Film; Manufacturer: Yageo; Manufacturer Part Number 1: RC0201FR-073KL; Resistance: 3kR; Max Power Dissipation: 50mW; Temperature Coefficient: 200ppm/°C; Value: 3k, 1%; Supplier 1: Digi-Key; Supplier Part Number 1: YAG2656CT-ND; Stock 1: 269780; Pricing 1: 1=0,10000, 10=0,03700, 100=0,01530, 1000=0,00685, 2500=0,00595, 5000=0,00491 (USD); RoHS: Yes; Case/Package: 0201; Case Code (Metric): 0603; Case Code (Imperial): 0201; Min Operating Temperature: -55°C; Max Operating Temperature: 125°C; Packaging: Tape and Reel; Resistor Type: Thick Film; Number of Terminations: 2; Tolerance: 1%; Features: Moisture Resistant; Length: 0.024inch; Width: 0.012inch; Height: 0.01inch; RoHS Compliant: Yes; ComponentLink1URL: http://www.yageo.com/documents/recent/PYu-RC_Group_51_RoHS_L_10.pdf?src-supplier=Digi-Key; ComponentLink1Description: http://www.yageo.com/documents/recent/PYu-RC_Group_51_RoHS_L_10.pdf?src-supplier=Digi-Key; ComponentLink2URL: http://www.yageo.com.tw/exep/pages/download/literatures/PYu-R_INT-thick_7.pdf?src-supplier=Digi-Key; ComponentLink2Description: http://www.yageo.com.tw/exep/pages/download/literatures/PYu-R_INT-thick_7.pdf?src-supplier=Digi-Key; ComponentLink3URL: http://www.yageo.com/documents/recent/PYu-RC_Group_51_RoHS_L_9.pdf?src-supplier=Digi-Key; ComponentLink3Description: http://www.yageo.com/documents/recent/PYu-RC_Group_51_RoHS_L_9.pdf?src-supplier=Digi-Key
R169 = Res_0402: Manufacturer: Yageo; Manufacturer Part Number 1: RC0201FR-0712K7L; Part Description: 12.7 kOhms ±1% 0.05W, 1/20W Chip Resistor 0201 (0603 Metric) Moisture Resistant Thick Film; Resistance: 12.7kR; Temperature Coefficient: 200ppm/°C; Max Power Dissipation: 50mW; Value: 12.7k, 1%; ComponentLink1URL: https://datasheet.ciiva.com/5924/1563626-5924912.pdf?src-supplier=Farnell; ComponentLink1Description: https://datasheet.ciiva.com/5924/1563626-5924912.pdf?src-supplier=Farnell; ComponentLink2URL: https://datasheet.ciiva.com/22661/1563626-22661319.pdf?src-supplier=Element14; ComponentLink2Description: https://datasheet.ciiva.com/22661/1563626-22661319.pdf?src-supplier=Element14; ComponentLink3URL: https://datasheet.ciiva.com/7660/1421516-7660807.pdf?src-supplier=Element14; ComponentLink3Description: https://datasheet.ciiva.com/7660/1421516-7660807.pdf?src-supplier=Element14; ComponentLink4URL: https://datasheet.ciiva.com/46391/1421516-46391339.pdf?src-supplier=Element14; ComponentLink4Description: https://datasheet.ciiva.com/46391/1421516-46391339.pdf?src-supplier=Element14; ComponentLink5URL: https://datasheet.ciiva.com/2467/pyu-r-int-thick-7-2467110.pdf?src-supplier=Digi-Key; ComponentLink5Description: https://datasheet.ciiva.com/2467/pyu-r-int-thick-7-2467110.pdf?src-supplier=Digi-Key; ComponentLink6URL: https://datasheet.ciiva.com/2467/pyu-r-int-thick-7-2467111.pdf?src-supplier=Digi-Key; ComponentLink6Description: https://datasheet.ciiva.com/2467/pyu-r-int-thick-7-2467111.pdf?src-supplier=Digi-Key; ComponentLink7URL: https://datasheet.ciiva.com/2467/pyu-r-int-thick-7-2467109.pdf?src-supplier=Digi-Key; ComponentLink7Description: https://datasheet.ciiva.com/2467/pyu-r-int-thick-7-2467109.pdf?src-supplier=Digi-Key; Supplier 1: Digi-Key; Supplier Part Number 1: 311-12.7KMCT-ND; Stock 1: 49027; Pricing 1: 1=0,10000, 10=0,03700, 100=0,01500, 1000=0,00672, 2500=0,00583, 5000=0,00482 (USD); RoHS: Yes; Case/Package: 0201; Case Code (Metric): 0603; Case Code (Imperial): 0201; Min Operating Temperature: -55°C; Max Operating Temperature: 125°C; Package Quantity: 1; Tolerance: 1%; Packaging: Tape and Reel; Resistor Type: Thick Film; Number of Terminations: 2; Features: Moisture Resistant; Series: RC; Length: 0.024inch; Width: 0.012inch; Height: 0.01inch; RoHS Compliant: Yes; ComponentLink8URL: https://datasheet.ciiva.com/2493/pyu-r-int-thick-7-2493806.pdf?src-supplier=Digi-Key; ComponentLink8Description: https://datasheet.ciiva.com/2493/pyu-r-int-thick-7-2493806.pdf?src-supplier=Digi-Key; ComponentLink9URL: https://datasheet.ciiva.com/2493/pyu-r-int-thick-7-2493807.pdf?src-supplier=Digi-Key; ComponentLink9Description: https://datasheet.ciiva.com/2493/pyu-r-int-thick-7-2493807.pdf?src-supplier=Digi-Key; ComponentLink10URL: https://datasheet.ciiva.com/2493/pyu-r-int-thick-7-2493805.pdf?src-supplier=Digi-Key; ComponentLink10Description: https://datasheet.ciiva.com/2493/pyu-r-int-thick-7-2493805.pdf?src-supplier=Digi-Key
R174 = Res_0402: Manufacturer: Panasonic Electronic Components; Part Description: RES SMD 10 OHM 1% 1/20W 0201; Manufacturer Part Number 1: ERJ-1GEF10R0C; Power (Watts): 0.05W, 1/20W; Resistance (Ohms): 10; Temperature Coefficient: ±200ppm/°C; Value: 10R, 1%; Supplier 1: Digi-Key; Supplier Part Number 1: P10.0ABCT-ND; Package / Case: 0201 (0603 Metric); Height: 0.010" (0.26mm); Supplier Device Package: 0201; Packaging: Cut Tape (CT); Composition: Thick Film; Category: Resistors; Tolerance: ±1%; Number of Terminations: 2; Size / Dimension: 0.024" L x 0.012" W (0.60mm x 0.30mm); Operating Temperature: -55°C ~ 125°C; Features: -; RoHS: RoHS Compliant
R176 = Res_0402: Manufacturer: Yageo; Manufacturer Part Number 1: RC0201FR-071KL; Part Description: 1 kOhms ±1% 0.05W, 1/20W Chip Resistor 0201 (0603 Metric) Moisture Resistant Thick Film; Resistance: 1kR; Power Rating: 50mW; Voltage Rating: 25V; Temperature Coefficient: 200ppm/°C; Value: 1k, 1%; Supplier 1: Digi-Key; Supplier Part Number 1: 311-1KMDKR-ND; Stock 1: 9099863; Pricing 1: 1=0,10000, 10=0,03700, 100=0,01530, 1000=0,00685, 2500=0,00595, 5000=0,00491 (USD); RoHS: Yes; Case/Package: 0201; Case Code (Metric): 0603; Case Code (Imperial): 0201; Contact Plating: Tin,Matte; Min Operating Temperature: -55°C; Max Operating Temperature: 125°C; Package Quantity: 10000; Packaging: Tape and Reel; Tolerance: 1%; Resistor Type: Thick Film; Number of Terminations: 2; Termination: SMD/SMT; Max Power Dissipation: 50mW; Working Voltage: 25V; Features: Moisture Resistant; Series: RC; Resistance Tolerance: 1%; Technology: THICK FILM; Construction: Rectangular; Length: 0.024inch; Width: 0.012inch; Height: 0.01inch; Depth: 0.3mm; Radiation Hardening: No; Military Standard: Not; Lead Free: Lead Free; RoHS Compliant: Yes; ComponentLink1URL: https://datasheet.ciiva.com/7672/1563626-7672204.pdf?src-supplier=Element14; ComponentLink1Description: https://datasheet.ciiva.com/7672/1563626-7672204.pdf?src-supplier=Element14; ComponentLink2URL: https://datasheet.ciiva.com/22698/1563626-22698505.pdf?src-supplier=Element14; ComponentLink2Description: https://datasheet.ciiva.com/22698/1563626-22698505.pdf?src-supplier=Element14; ComponentLink3URL: https://datasheet.ciiva.com/29721/pyu-r-int-thick-7-29721196.pdf?src-supplier=Digi-Key; ComponentLink3Description: https://datasheet.ciiva.com/29721/pyu-r-int-thick-7-29721196.pdf?src-supplier=Digi-Key; ComponentLink4URL: https://datasheet.ciiva.com/29721/pyu-r-int-thick-7-29721195.pdf?src-supplier=Digi-Key; ComponentLink4Description: https://datasheet.ciiva.com/29721/pyu-r-int-thick-7-29721195.pdf?src-supplier=Digi-Key; ComponentLink5URL: https://datasheet.ciiva.com/8896/pyu-rc0201-51-rohs-l-8-8896174.pdf?src-supplier=Avnet; ComponentLink5Description: https://datasheet.ciiva.com/8896/pyu-rc0201-51-rohs-l-8-8896174.pdf?src-supplier=Avnet
R179 = Res_0402: Part Description: 470 Ohms ±1% 0.05W, 1/20W Chip Resistor 0201 (0603 Metric) Moisture Resistant Thick Film; Manufacturer: Yageo; Manufacturer Part Number 1: RC0201FR-07470RL; Voltage Rating (DC): 25V; Value: 470, 1%; ComponentLink1URL: https://datasheet.ciiva.com/8944/crcw0201e3-8944937.pdf?src-supplier=Avnet; ComponentLink1Description: https://datasheet.ciiva.com/8944/crcw0201e3-8944937.pdf?src-supplier=Avnet; ComponentLink2URL: https://datasheet.ciiva.com/2473/crcw0201e3-2473436.pdf?src-supplier=Digi-Key; ComponentLink2Description: https://datasheet.ciiva.com/2473/crcw0201e3-2473436.pdf?src-supplier=Digi-Key; ComponentLink3URL: https://datasheet.ciiva.com/2473/crcw0201e3-2473437.pdf?src-supplier=Digi-Key; ComponentLink3Description: https://datasheet.ciiva.com/2473/crcw0201e3-2473437.pdf?src-supplier=Digi-Key; ComponentLink4URL: https://datasheet.ciiva.com/2473/crcw0201e3-2473438.pdf?src-supplier=Digi-Key; ComponentLink4Description: https://datasheet.ciiva.com/2473/crcw0201e3-2473438.pdf?src-supplier=Digi-Key; ComponentLink5URL: https://datasheet.ciiva.com/16394/dcrcwe3-16394575.pdf?src-supplier=Future+Electronics; ComponentLink5Description: https://datasheet.ciiva.com/16394/dcrcwe3-16394575.pdf?src-supplier=Future+Electronics; Supplier 1: Digi-Key; Supplier Part Number 1: YAG2689CT-ND; Stock 1: 296760; Pricing 1: 1=0,1, 10=0,027, 50=0,0172, 100=0,0143, 500=0,00988, 1000=0,00854, 5000=0,00629 (USD); RoHS: Yes; ComponentLink6URL: https://datasheet.ciiva.com/7672/1563626-7672231.pdf?src-supplier=Element14; ComponentLink6Description: https://datasheet.ciiva.com/7672/1563626-7672231.pdf?src-supplier=Element14; ComponentLink7URL: https://datasheet.ciiva.com/22698/1563626-22698527.pdf?src-supplier=Element14; ComponentLink7Description: https://datasheet.ciiva.com/22698/1563626-22698527.pdf?src-supplier=Element14
R184 = Res_0402: Part Description: 330 Ohms ±1% 0.05W, 1/20W Chip Resistor 0201 (0603 Metric) Thick Film; Manufacturer: Vishay Dale; Manufacturer Part Number 1: CRCW0201330RFKED; Power Rating: 50mW; Voltage Rating: 30V; Temperature Coefficient: 100ppm/°C; Value: 330R, 1%; Supplier 1: Digi-Key; Supplier Part Number 1: 541-330AABCT-ND; Stock 1: 245078; Pricing 1: 1=0,27000, 10=0,23000, 100=0,08990, 1000=0,03762, 2500=0,03448, 5000=0,03135 (USD); RoHS: Yes; Case/Package: 0201; Weight: 6E-06oz; Case Code (Imperial): 0201; Case Code (Metric): 0603; Contact Plating: Tin; Size Code: 0201; Min Operating Temperature: -55°C; Max Operating Temperature: 155°C; Resistance: 330R; Tolerance: 1%; Packaging: Tape and Reel; Package Quantity: 1; Resistor Type: Thick Film; Number of Terminations: 2; Max Power Dissipation: 50mW; Series: CRCW; Construction: Rectangular; Length: 0.6mm; Width: 0.3mm; Height: 0.011inch; Depth: 0.3mm; Radiation Hardening: No; Military Standard: Not; Lead Free: Lead Free; RoHS Compliant: Yes; ComponentLink1URL: https://datasheet.ciiva.com/8944/crcw0201e3-8944937.pdf?src-supplier=Avnet; ComponentLink1Description: https://datasheet.ciiva.com/8944/crcw0201e3-8944937.pdf?src-supplier=Avnet; ComponentLink2URL: https://datasheet.ciiva.com/2473/crcw0201e3-2473436.pdf?src-supplier=Digi-Key; ComponentLink2Description: https://datasheet.ciiva.com/2473/crcw0201e3-2473436.pdf?src-supplier=Digi-Key; ComponentLink3URL: https://datasheet.ciiva.com/2473/crcw0201e3-2473437.pdf?src-supplier=Digi-Key; ComponentLink3Description: https://datasheet.ciiva.com/2473/crcw0201e3-2473437.pdf?src-supplier=Digi-Key; ComponentLink4URL: https://datasheet.ciiva.com/2473/crcw0201e3-2473438.pdf?src-supplier=Digi-Key; ComponentLink4Description: https://datasheet.ciiva.com/2473/crcw0201e3-2473438.pdf?src-supplier=Digi-Key; ComponentLink5URL: https://datasheet.ciiva.com/16394/dcrcwe3-16394575.pdf?src-supplier=Future+Electronics; ComponentLink5Description: https://datasheet.ciiva.com/16394/dcrcwe3-16394575.pdf?src-supplier=Future+Electronics
XO1 = RPT7050A: Part Description: TCXO 30.72MHz, E6245LF; Manufacturer: Rakon; Manufacturer Part Number 1: E6245LF; Supplier 1: Rakon; Supplier Part Number 1: E6245LF
XO2 = TXCO: Part Description: TCXO 30.72MHz, E5280LF; Manufacturer: Rakon; Manufacturer Part Number 1: E5280LF; Supplier 1: Rakon; Supplier Part Number 1: E5280LF